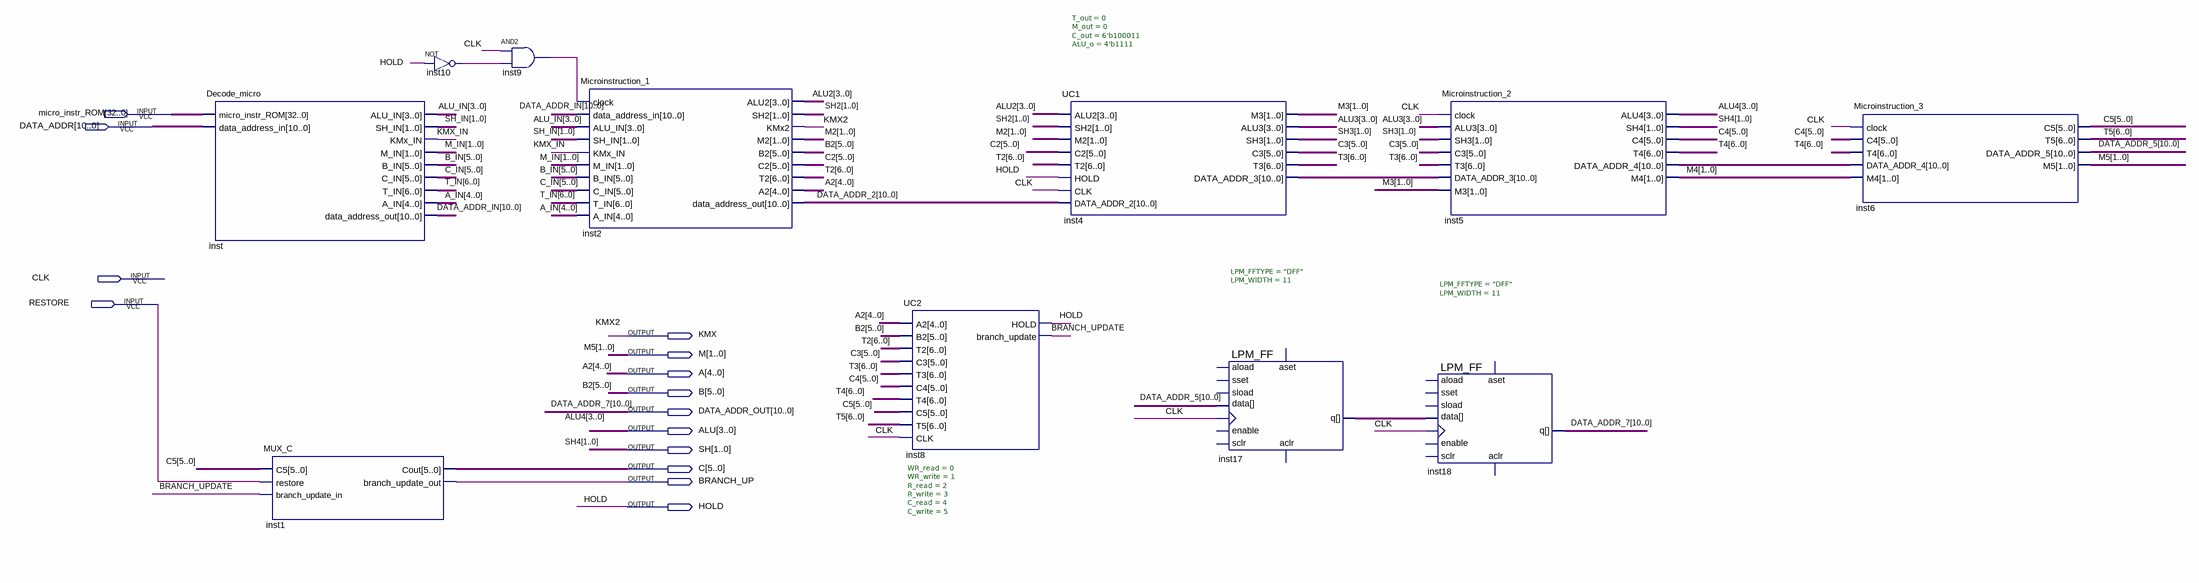
[diagram p0: schematic sheet]
// Quartus schematic pipeline.bdf as structural Verilog: 11 symbols, 14 pins
module pipeline (
  input  [32:0] micro_instr_ROM,
  input  [10:0] DATA_ADDR,
  input  CLK,
  input  RESTORE,
  output KMX,
  output [1:0] M,
  output [4:0] A,
  output [5:0] B,
  output [10:0] DATA_ADDR_OUT,
  output [3:0] ALU,
  output [1:0] SH,
  output [5:0] C,
  output BRANCH_UP,
  output HOLD
);

  wire BRANCH_UPDATE, inst9_out, inst10_out, KMX_IN;
  wire [1:0] M2, M3, M4, M_IN, SH2, SH3, SH_IN;
  wire [3:0] ALU2, ALU3, ALU_IN;
  wire [4:0] A_IN;
  wire [5:0] B_IN, C2, C3, C4, C5, C_IN;
  wire [6:0] T2, T3, T4, T5, T_IN;
  wire [10:0] DATA_ADDR_2, DATA_ADDR_5, DATA_ADDR_IN, inst4_data_addr_3, inst5_data_addr_4, inst17_q;

  Decode_micro inst (
    .micro_instr_ROM(micro_instr_ROM), .data_address_in(DATA_ADDR), .ALU_IN(ALU_IN), .SH_IN(SH_IN),
    .KMx_IN(KMX_IN), .M_IN(M_IN), .B_IN(B_IN), .C_IN(C_IN), .T_IN(T_IN), .A_IN(A_IN),
    .data_address_out(DATA_ADDR_IN));
  MUX_C inst1 (.C5(C5), .restore(RESTORE), .branch_update_in(BRANCH_UPDATE), .Cout(C), .branch_update_out(BRANCH_UP));
  not inst10 (inst10_out, HOLD);
  and inst9 (inst9_out, CLK, inst10_out);
  Microinstruction_1 inst2 (
    .clock(inst9_out), .data_address_in(DATA_ADDR_IN), .ALU_IN(ALU_IN), .SH_IN(SH_IN), .KMx_IN(KMX_IN),
    .M_IN(M_IN), .B_IN(B_IN), .C_IN(C_IN), .T_IN(T_IN), .A_IN(A_IN), .ALU2(ALU2), .SH2(SH2), .KMx2(KMX),
    .M2(M2), .B2(B), .C2(C2), .T2(T2), .A2(A), .data_address_out(DATA_ADDR_2));
  UC2 #(.WR_read(0), .WR_write(1), .R_read(2), .R_write(3), .C_read(4), .C_write(5)) inst8 (
    .A2(A), .B2(B), .T2(T2), .C3(C3), .T3(T3), .C4(C4), .T4(T4), .C5(C5), .T5(T5), .CLK(CLK), .HOLD(HOLD),
    .branch_update(BRANCH_UPDATE));
  UC1 #(.T_out(0), .M_out(0), .C_out(6'b100011), .ALU_o(4'b1111)) inst4 (
    .ALU2(ALU2), .SH2(SH2), .M2(M2), .C2(C2), .T2(T2), .HOLD(HOLD), .CLK(CLK), .DATA_ADDR_2(DATA_ADDR_2),
    .M3(M3), .ALU3(ALU3), .SH3(SH3), .C3(C3), .T3(T3), .DATA_ADDR_3(inst4_data_addr_3));
  LPM_FF #(.LPM_FFTYPE("DFF"), .LPM_WIDTH(11)) inst17 (
    .clock(CLK), .data(DATA_ADDR_5), .q(inst17_q));  // open: enable, aload, sset, sload, aset, sclr, aclr
  Microinstruction_2 inst5 (
    .clock(CLK), .ALU3(ALU3), .SH3(SH3), .C3(C3), .T3(T3), .DATA_ADDR_3(inst4_data_addr_3), .M3(M3),
    .ALU4(ALU), .SH4(SH), .C4(C4), .T4(T4), .DATA_ADDR_4(inst5_data_addr_4), .M4(M4));
  LPM_FF #(.LPM_FFTYPE("DFF"), .LPM_WIDTH(11)) inst18 (
    .clock(CLK), .data(inst17_q), .q(DATA_ADDR_OUT));  // open: enable, aload, sset, sload, aset, sclr, aclr
  Microinstruction_3 inst6 (
    .clock(CLK), .C4(C4), .T4(T4), .DATA_ADDR_4(inst5_data_addr_4), .M4(M4), .C5(C5), .T5(T5),
    .DATA_ADDR_5(DATA_ADDR_5), .M5(M));

  // Other names for the same wires on the sheet: A2[4:0] = A; ALU4[3:0] = ALU; B2[5:0] = B;
  //   DATA_ADDR_7[10:0] = DATA_ADDR_OUT; KMX2 = KMX; M5[1:0] = M; SH4[1:0] = SH
endmodule
